# EAGLE design PWM (EAGLE 8.5.2)
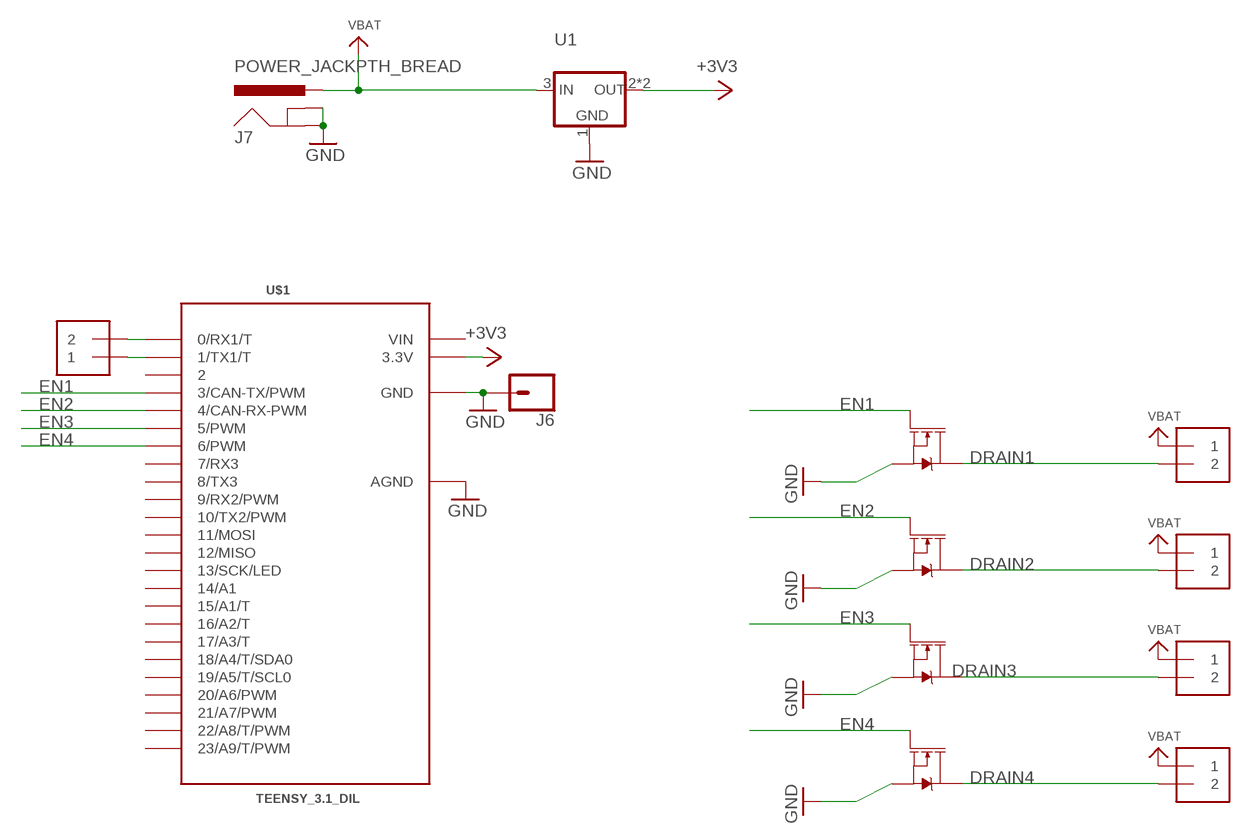
[diagram p0: schematic, sheet 1]

## Parts
J1  1X2-3.5MM  [1X2-3.5MM]
J2  1X2-3.5MM  [1X2-3.5MM]
J3  1X2-3.5MM  [1X2-3.5MM]
J4  1X2-3.5MM  [1X2-3.5MM]
J5  1X2-3.5MM  [1X2-3.5MM]
J6  CONN_01  [1X01]
J7  POWER_JACKPTH_BREAD  [POWER_JACK_PTH_BREAD]
Q1  35A/25V/8.5mΩ  MOSFET-NCH-FDD8780  [DPAK]
Q3  35A/25V/8.5mΩ  MOSFET-NCH-FDD8780  [DPAK]
Q5  35A/25V/8.5mΩ  MOSFET-NCH-FDD8780  [DPAK]
Q6  35A/25V/8.5mΩ  MOSFET-NCH-FDD8780  [DPAK]
U1  VREG_SOT223  [SOT223-R]
U$1  TEENSY_3.1_DIL  [TEENSY3-DIL]

## Nets
+3V3: U1.2(OUT) U1.4(OUT) U$1.3.3V
DRAIN1: J2.2 Q1.4(D)
DRAIN2: J3.2 Q3.4(D)
DRAIN3: J4.2 Q5.4(D)
DRAIN4: J5.2 Q6.4(D)
EN1: Q1.1(G) U$1.3(3/CAN-TX/PWM)
EN2: Q3.1(G) U$1.4(4/CAN-RX-PWM)
EN3: Q5.1(G) U$1.5(5/PWM)
EN4: Q6.1(G) U$1.6(6/PWM)
GND: J6.1 J7.GND J7.GNDBREAK Q1.3(S) Q3.3(S) Q5.3(S) Q6.3(S) U1.1(GND) U$1.AGND U$1.GND
N$1: J1.1 U$1.1(1/TX1/T)
N$2: J1.2 U$1.0(0/RX1/T)
VBAT: J2.1 J3.1 J4.1 J5.1 J7.PWR U1.3(IN)
Unconnected: U$1.2 U$1.7(7/RX3) U$1.8(8/TX3) U$1.9(9/RX2/PWM) U$1.10(10/TX2/PWM) U$1.11(11/MOSI) U$1.12(12/MISO) U$1.13(13/SCK/LED) U$1.14/A0(14/A1) U$1.15/A1(15/A1/T) U$1.16/A2(16/A2/T) U$1.17/A3(17/A3/T) U$1.18/A4(18/A4/T/SDA0) U$1.19/A5(19/A5/T/SCL0) U$1.20/A6(20/A6/PWM) U$1.21/A7(21/A7/PWM) U$1.22/A8(22/A8/T/PWM) U$1.23/A9(23/A9/T/PWM)

## Power pins joined to a net without a drawn wire
VIN: U$1.VIN

## Library data of the parts
J1-J5 = adafruit:1X2: 3.5mm Terminal block http://www.ladyada.net/library/pcb/eaglelibrary.html
J6 = SparkFun-Connectors:CONN_01: Single connection point. Often used as Generic Header-pin footprint for 0.1 inch spaced/style header connections On any of the 0.1 inch spaced packages, you can populate with these: Break Away Headers - Straight <https://www.sparkfun.com/products/116> (PRT-00116) Break Away Male Headers - Right Angle <https://www.sparkfun.com/products/553> (PRT-00553) Female Headers <https://www.sparkfun.com/products/115> (PRT-00115) Break Away Headers - Machine Pin <https://www.sparkfun.com/products/117> (PRT-00117) Break Away Female Headers - Swiss Machine Pin <https://www.sparkfun.com/products/743> (PRT-00743) This device is also useful as a general connection point to wire up your design to another part of your project. Our various solder wires solder well into these plated through hole pads. Hook-Up Wire - Assortment (Stranded, 22 AWG) <https://www.sparkfun.com/products/11375> (PRT-11375) Hook-Up Wire - Assortment (Solid Core, 22 AWG) <https://www.sparkfun.com/products/11367> (PRT-11367) View the entire wire category on our website here <https://www.sparkfun.com/categories/141> Special notes: SMTSO-256-ET is a "flush mount" nut for a 4-40 screw. We mostly use this on specialty testbeds; it is a nice way to connect hardware to your PCB at an adjustable hieght. Also note, the SNAP packages are for using a snappable style connector. We sell a baggie of snaps and they are also used on two LilyPad designs: Snap Assortment - 30 pack (male and female) <https://www.sparkfun.com/products/11347> (DEV-11347) LilyPad Arduino SimpleSnap <https://www.sparkfun.com/products/10941> (DEV-10941) LilyPad SimpleSnap Protoboard <https://www.sparkfun.com/products/10940> (DEV-10940)
J7 = SparkFun-Connectors:POWER_JACK: Power Jack Connector This is the standard 5.5mm barrel jack for power. The PTH is the most common, proven, reliable, footprint. The Slot footprint only works if the mill layer is transmitted to the PCB fab house so be warned. Here are the connectors we sell at SparkFun: DC Barrel Power Jack/Connector <https://www.sparkfun.com/products/119> (PRT-00119) DC Barrel Power Jack/Connector (SMD) <https://www.sparkfun.com/products/12748> (PRT-12748) DC Barrel Jack Adapter - Breadboard Compatible <https://www.sparkfun.com/products/10811> (PRT-10811) It is used on this SparkFun product (and many, many others): SparkFun RedBoard - Programmed with Arduino <https://www.sparkfun.com/products/12757> (DEV-12757) Also, if you need a mating power supply or connector, please check these out: Wall Adapter Power Supply - 9VDC 650mA <https://www.sparkfun.com/products/298> (TOL-00298) DC Barrel Jack Adapter - Male <https://www.sparkfun.com/products/10287> (PRT-10287); PROD_ID: PRT-10811
Q1 Q3 Q5 Q6 = SparkFun-DiscreteSemi:MOSFET-NCH: N-channel MOSFETs Voltage controlled devices that allow control of high current outputs. SparkFun Products: SparkFun OpenScale <https://www.sparkfun.com/products/13261> SparkFun Digital Sandbox <https://www.sparkfun.com/products/12651> SparkFun Monster Moto Shield <https://www.sparkfun.com/products/10182> SparkFun MOSFET Power Controller <https://www.sparkfun.com/products/11214>; PROD_ID: TRANS-09984
U1 = microbuilder:VREG_SOT223: SOT-223 Fixed Voltage Regulators Part Current Out V Out V In V Dropout θJA (°C/W) TJ (°C) Operating Temp Digikey Part No. AP1117 1A 3.3V 18V 1.1V@500mA, 1.3V@1A 107°C/W 150°C -40°C-125°C AP1117IE33G-13DICT-ND Max operating temp can be calculated using θJA, TJ (max junction temperature), and power in watts. Set the "Maximum Ambient Temperature" until it reaches TJ ("Max Junction Temperature"), which is the absolute limit for safe use of the regulator: Heat Sink Temperature Calculator <http://www.daycounter.com/Calculators/Heat-Sink-Temperature-Calculator.phtml> For example, With 12V source into a 3.3V LP2985 and a 30mA load, we are dissipating (12V-3.3V) * 0.03A = 0.261W. With a θJA of 206 °C/W, a TJ of 150°C, and 261mW we can safely use the chip without a heat sink up to 75°C (=147.1°C Junction Temperature).
U$1 = Teensy_3_and_LC_Series_Boards_v1.0:TEENSY_3.1_DIL: Teensy 3.1 or 3.2 in a DIL Layout.

## Board
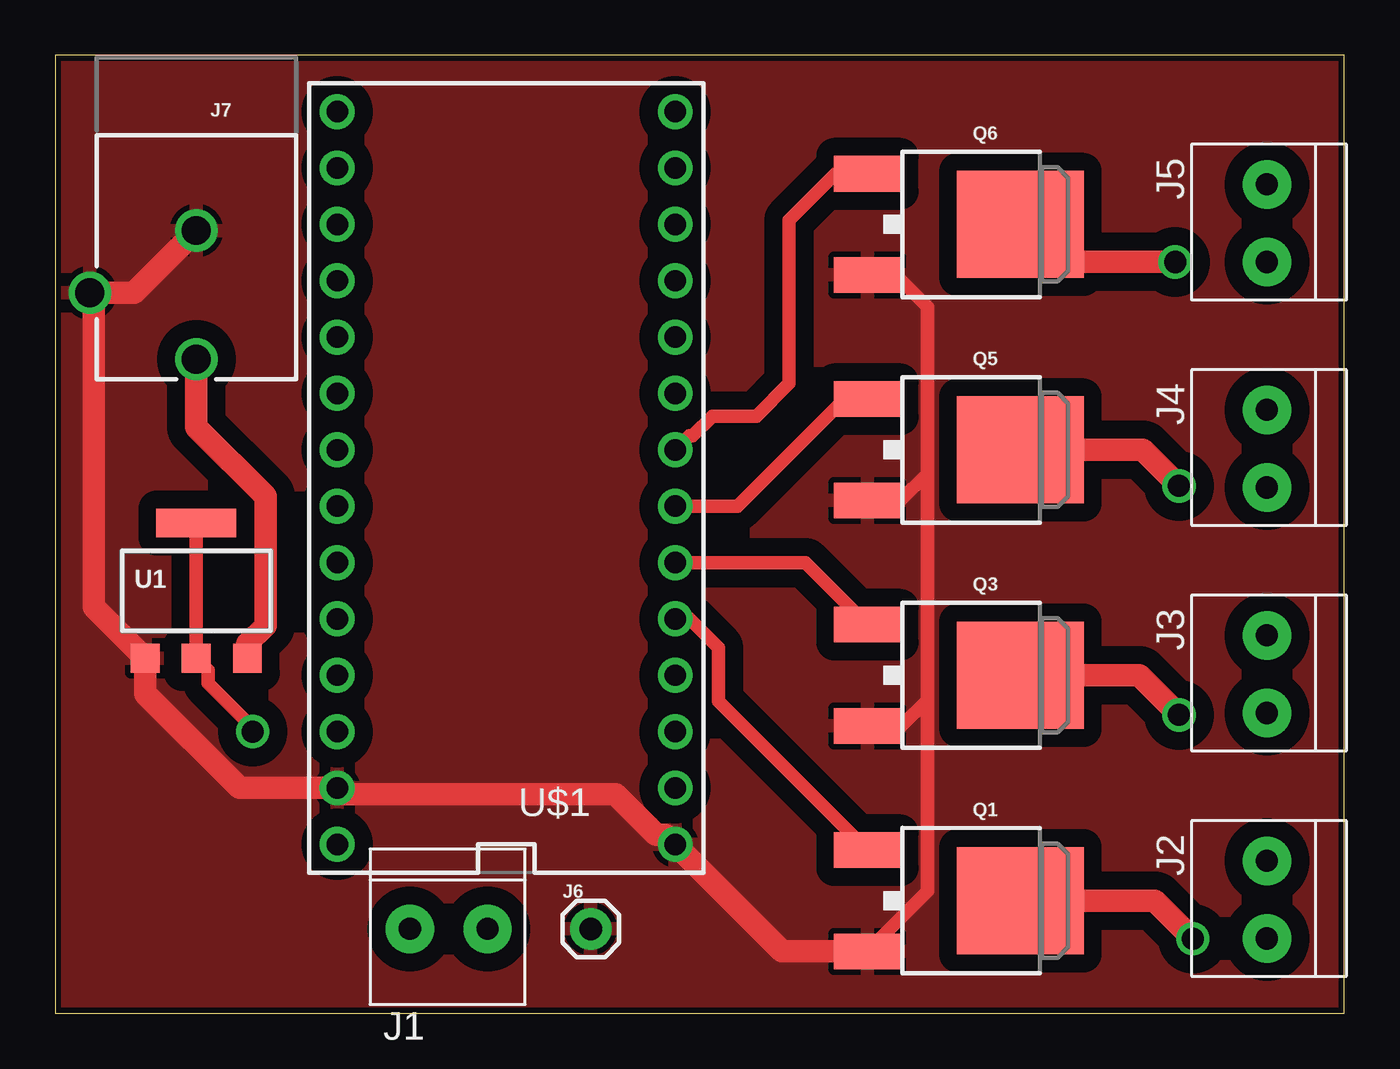
[diagram p1: board, top side]
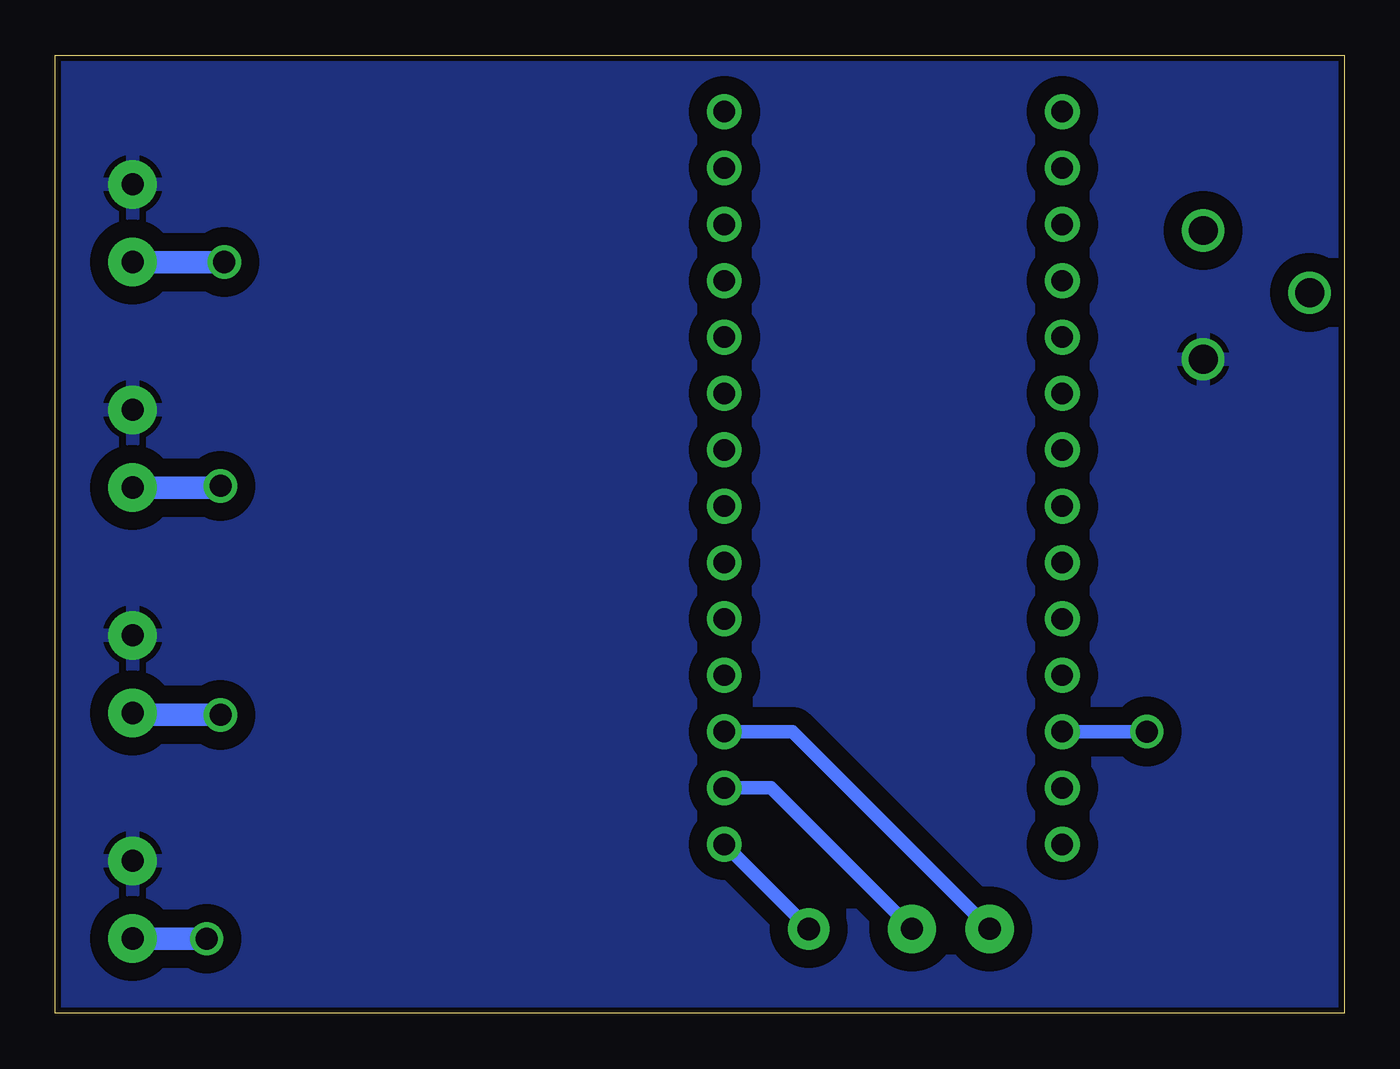
[diagram p2: board, bottom side, seen from below]

Size 58.09 x 43.17 mm. Coordinates in mm from the lower left corner, seen from the top.
Outline: 0,0 58.09,0 58.09,43.17 0,43.17 0,0
Copper layers (1*16): Top 0.035mm / dielectric 1.5mm / Bottom 0.035mm
Design rules "othermill_1_32": minimum track width 24mil, minimum drill 31mil, track to track 32mil, track to pad 32mil, pad to pad 32mil, via to via 32mil, smd to smd 8mil, copper to edge 10mil, drill to drill 8mil, minimum pad ring 12mil, minimum via ring 8mil, stop-mask expansion 2mil, vias tented up to drill 20mil, thermal gap 10mil

### Footprints (pad centres in the part's own frame; a part is rotated, then mirrored left to right if it is on the bottom)
1X2-3.5MM = drill 1 pad 2.184: 1 1.8,0; 2 -1.7,0
1X01 = drill 1.016 pad 1.88: 1 0,0
POWER_JACK_PTH_BREAD = drill 1.3: GND 0,7.9; GNDBREAK 4.8,10.7; PWR 0,13.7
DPAK = smd 1.6 x 3: 1 -2.28,-5.31; 3 2.28,-5.31 | smd 4.826 x 5.715: 4 0,1.588
SOT223-R = smd 1.3 x 1.3: 1 -2.3,-3.05; 2 0,-3.05; 3 2.3,-3.05 | smd 3.6 x 1.3: 4 0,3.05
TEENSY3-DIL = drill 0.965: 0 -7.62,13.97; 1 -7.62,11.43; 2 -7.62,8.89; 3 -7.62,6.35; 3.3V 7.62,11.43; 4 -7.62,3.81; 5 -7.62,1.27; 6 -7.62,-1.27; 7 -7.62,-3.81; 8 -7.62,-6.35; 9 -7.62,-8.89; 10 -7.62,-11.43; 11 -7.62,-13.97; 12 -7.62,-16.51; 13 7.62,-16.51; 14/A0 7.62,-13.97; 15/A1 7.62,-11.43; 16/A2 7.62,-8.89; 17/A3 7.62,-6.35; 18/A4 7.62,-3.81; 19/A5 7.62,-1.27; 20/A6 7.62,1.27; 21/A7 7.62,3.81; 22/A8 7.62,6.35; 23/A9 7.62,8.89; AGND 7.62,13.97; GND -7.62,16.51; VIN 7.62,16.51

### Placement (x,y rotation side)
J1  17.78,3.81 180 top
J2  54.61,5.08 90 top
J3  54.61,15.24 90 top
J4  54.61,25.4 90 top
J5  54.61,35.56 90 top
J6  24.13,3.81 0 top
J7  6.35,43.18 180 top
Q1  41.91,5.08 270 top
Q3  41.91,15.24 270 top
Q5  41.91,25.4 270 top
Q6  41.91,35.56 270 top
U1  6.35,19.05 0 top
U$1  20.32,24.13 180 top

### Tracks (layer width: path | path; a pad name or v marks a point on that pad's centre or on a via)
+3V3  (via drill 1)
  Top 0.61: v8.89,12.7 8.89,12.88 6.88,14.89 6.88,15.47 U1.2 U1.4
  Bottom 0.61: v8.89,12.7 U$1.3.3V
DRAIN1  (via drill 1)
  Top 1.016: Q1.4 49.56,5.08 v51.27,3.36
  Bottom 1.016: v51.27,3.36 54.59,3.36 J2.2
DRAIN2  (via drill 1)
  Top 1.016: Q3.4 48.86,15.24 v50.65,13.46
  Bottom 1.016: v50.65,13.46 54.52,13.46 J3.2
DRAIN3  (via drill 1)
  Top 1.016: Q5.4 49.02,25.4 v50.65,23.77
  Bottom 1.016: v50.65,23.77 50.72,23.7 J4.2
DRAIN4  (via drill 1)
  Top 1.016: Q6.4 45.19,33.87 v50.48,33.87
  Bottom 1.016: v50.48,33.87 v50.48,33.86 J5.2
EN1
  Top 0.61: Q1.1 29.89,14.07 29.89,16.48 28.59,17.78 U$1.3
EN2
  Top 0.61: Q3.1 33.8,20.32 U$1.4
EN3
  Top 0.61: U$1.5 30.74,22.86 35.56,27.68 Q5.1
EN4
  Top 0.61: U$1.6 28.57,26.04 28.73,26.04 29.62,26.92 31.6,26.92 33.07,28.39 33.07,35.75 35.16,37.84 Q6.1
GND
  Top 0.61: Q1.3 39.3,5.5 39.3,14.12 | 39.3,14.12 39.3,24.33 | 39.3,24.33 39.3,31.85 37.87,33.28 Q6.3 | Q5.3 38.09,23.12 39.3,24.33 | Q3.3 38.14,12.96 39.3,14.12
  Top 1.016: J7.GND 3.55,32.48 J7.GNDBREAK 1.72,32.31 1.72,18.33 U1.1 4.05,14.4 8.29,10.16 U$1.AGND 12.98,9.88 25.24,9.88 27.07,8.05 27.51,8.05 U$1.GND 32.76,2.8 Q1.3
  Bottom 0.61: J6.1 U$1.GND
  pour Top: -6.35,-5.08 -6.35,49.53 69.85,49.53 69.85,-5.08
N$1
  Bottom 0.61: J1.1 24.87,12.7 U$1.1
N$2
  Bottom 0.61: J1.2 25.83,10.16 U$1.0
VBAT
  Top 1.016: J7.PWR 6.35,26.42 9.47,23.3 9.47,17.48 8.65,16.66 U1.3
  pour Bottom: -3.81,45.72 62.23,45.72 62.23,-2.54 -3.81,-2.54